# EAGLE schematic Evap-Lite V2.1 (EAGLE 9.5.2)
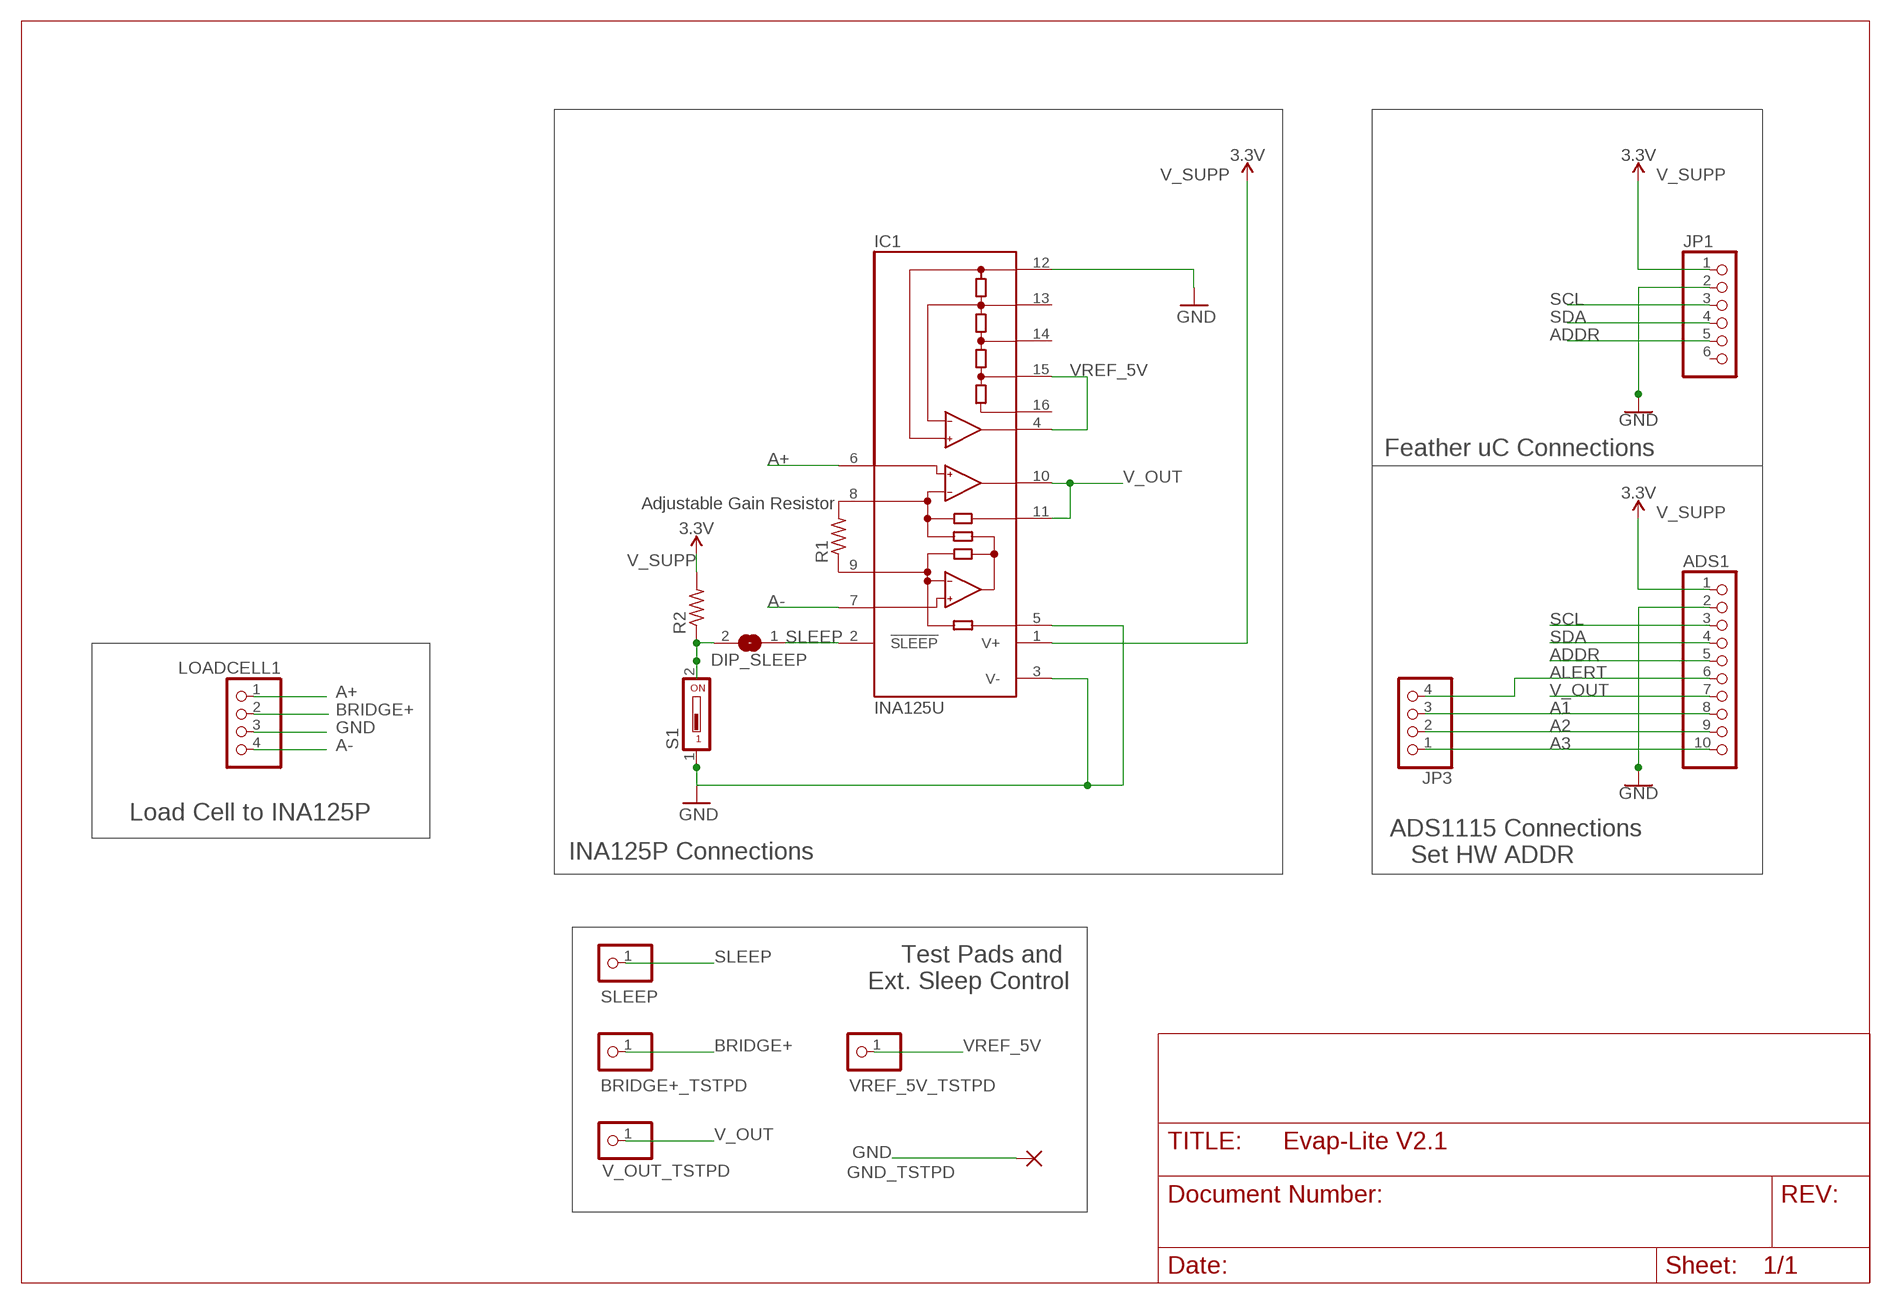
[diagram p0: schematic, sheet 1]

## Parts
ADS1  PINHD-1X10  [1X10]
BRIDGE+_TSTPD  PINHD-1X1  [1X01]
DIP_SLEEP  SJ  [SJ]
GND_TSTPD  WIREPADSMD2,54-5,08  [SMD2,54-5,08]
IC1  INA125U  [SO16-1]
JP1  PINHD-1X6  [1X06]
JP3  PINHD-1X4  [1X04]
LOADCELL1  PINHD-1X4  [1X04]
R1  R-US_R0603  [R0603]
R2  R-US_R1206  [R1206]
S1  DS01  [DS-01]
SLEEP  PINHD-1X1  [1X01]
V_OUT_TSTPD  PINHD-1X1  [1X01]
VREF_5V_TSTPD  PINHD-1X1  [1X01]

## Nets
A1: ADS1.8 JP3.3
A2: ADS1.9 JP3.2
A3: ADS1.10 JP3.1
A+: IC1.6(+IN) LOADCELL1.1
A-: IC1.7(-IN) LOADCELL1.4
ADDR: ADS1.5 JP1.5
ALERT: ADS1.6 JP3.4
BRIDGE+: BRIDGE+_TSTPD.1 LOADCELL1.2
GND: ADS1.2 GND_TSTPD.1(P) IC1.3(V-) IC1.5(REF) IC1.12(REFCOM) JP1.2 LOADCELL1.3 S1.1
N$22: DIP_SLEEP.2 R2.1 S1.2
RG+: IC1.9(RG) R1.1
RG-: IC1.8(RG) R1.2
SCL: ADS1.3 JP1.3
SDA: ADS1.4 JP1.4
SLEEP: DIP_SLEEP.1 IC1.2(!SLEEP) SLEEP.1
V_OUT: ADS1.7 IC1.10(OUT) IC1.11(SENSE) V_OUT_TSTPD.1
V_SUPP: ADS1.1 IC1.1(V+) JP1.1 R2.2 ; supply symbol labelled 3.3V
VREF_5V: IC1.4(REFOUT) IC1.15(REF5) VREF_5V_TSTPD.1
Unconnected: IC1.13(REFBG) IC1.14(REF2.5) IC1.16(REF10) JP1.6

## Notes on the sheet
- Feather uC Connections
- Adjustable Gain Resistor
- Load Cell to INA125P
- INA125P Connections
- ADS1115 Connections
     Set HW ADDR
- Test Pads and 
  Ext. Sleep Control

## Library data of the parts
ADS1 = pinhead:PINHD-1X10: PIN HEADER
BRIDGE+_TSTPD SLEEP V_OUT_TSTPD VREF_5V_TSTPD = pinhead:PINHD-1X1: PIN HEADER
DIP_SLEEP = jumper:SJ: SMD solder JUMPER
GND_TSTPD = wirepad:WIREPAD: Wire PAD connect wire on PCB
IC1 = burr-brown:INA125: Instrumentation Amplifier with Precision Voltage Reference; MF: TEXAS INSTRUMENT CONNECTORS; MPN: INA125U; OC_FARNELL: 1304375; OC_NEWARK: 80K5901
JP1 = pinhead:PINHD-1X6: PIN HEADER
JP3 LOADCELL1 = pinhead:PINHD-1X4: PIN HEADER
R1 R2 = rcl:R-US_: RESISTOR, American symbol; SPICEPREFIX: R
S1 = switch-dil:DS01: DIL/CODE SWITCH; OC_FARNELL: unknown; OC_NEWARK: unknown